# Altium schematic sheet Wi-Fi AP6212.SchDoc
size A4; SheetNumber: 6; SheetTotal: 12
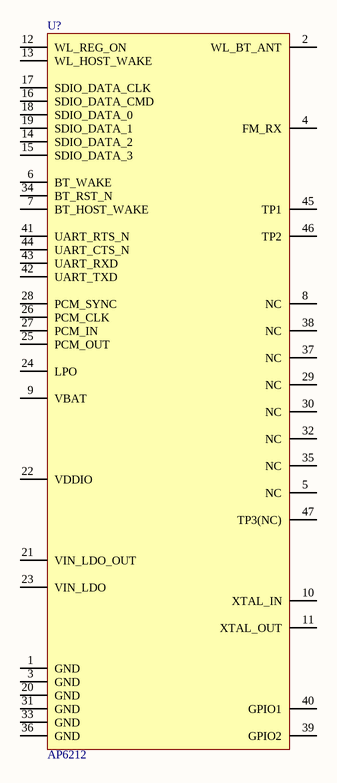
[diagram p0: Wi-Fi AP6212.SchDoc]

## Parts
U?  AP6212  [QFN-44_L12.0-W12.0-P0.90-TL_AP6212]

## Nets

Not connected (* = marked no-connect by the designer): U? 1(GND) 2(WL_BT_ANT) 3(GND) 4(FM_RX) 5(NC) 6(BT_WAKE) 7(BT_HOST_WAKE) 8(NC) 9(VBAT) 10(XTAL_IN) 11(XTAL_OUT) 12(WL_REG_ON) 13(WL_HOST_WAKE) 14(SDIO_DATA_2) 15(SDIO_DATA_3) 16(SDIO_DATA_CMD) 17(SDIO_DATA_CLK) 18(SDIO_DATA_0) 19(SDIO_DATA_1) 20(GND) 21(VIN_LDO_OUT) 22(VDDIO) 23(VIN_LDO) 24(LPO) 25(PCM_OUT) 26(PCM_CLK) 27(PCM_IN) 28(PCM_SYNC) 29(NC) 30(NC) 31(GND) 32(NC) 33(GND) 34(BT_RST_N) 35(NC) 36(GND) 37(NC) 38(NC) 39(GPIO2) 40(GPIO1) 41(UART_RTS_N) 42(UART_TXD) 43(UART_RXD) 44(UART_CTS_N) 45(TP1) 46(TP2) 47(TP3(NC))

## Library data of the parts
U? = AP6212: WiFi+Bluetooth 4.0+FM RX Module; MANUFACTURER: AMPAK Tech; Part Number: AP6212; COMPONENTLINK1URL: https://datasheet.lcsc.com/lcsc/2111121030_AMPAK-Tech-AP6212_C2798300.pdf; COMPONENTLINK1DESCRIPTION: Datasheet; PACKAGE: ESP-12F; Part Status: Active